# EasyEDA Pro project RM2025_超级电容控制器_IMCA.eprj, schematic 超电_V2.3.1

## Sheets
1 MCU及通信: Board Name: 超电V2.3; Create Date: 2025-06-12; Page Name: MCU及通信; Project Name: RM2025_超级电容控制器_IMCA; Schematic Name: 超电_V2.3.1; Update Date: 2025-06-12; Company: IMCA战队; Drawed: TJL; Page Size: A4; Version: V2.3.1
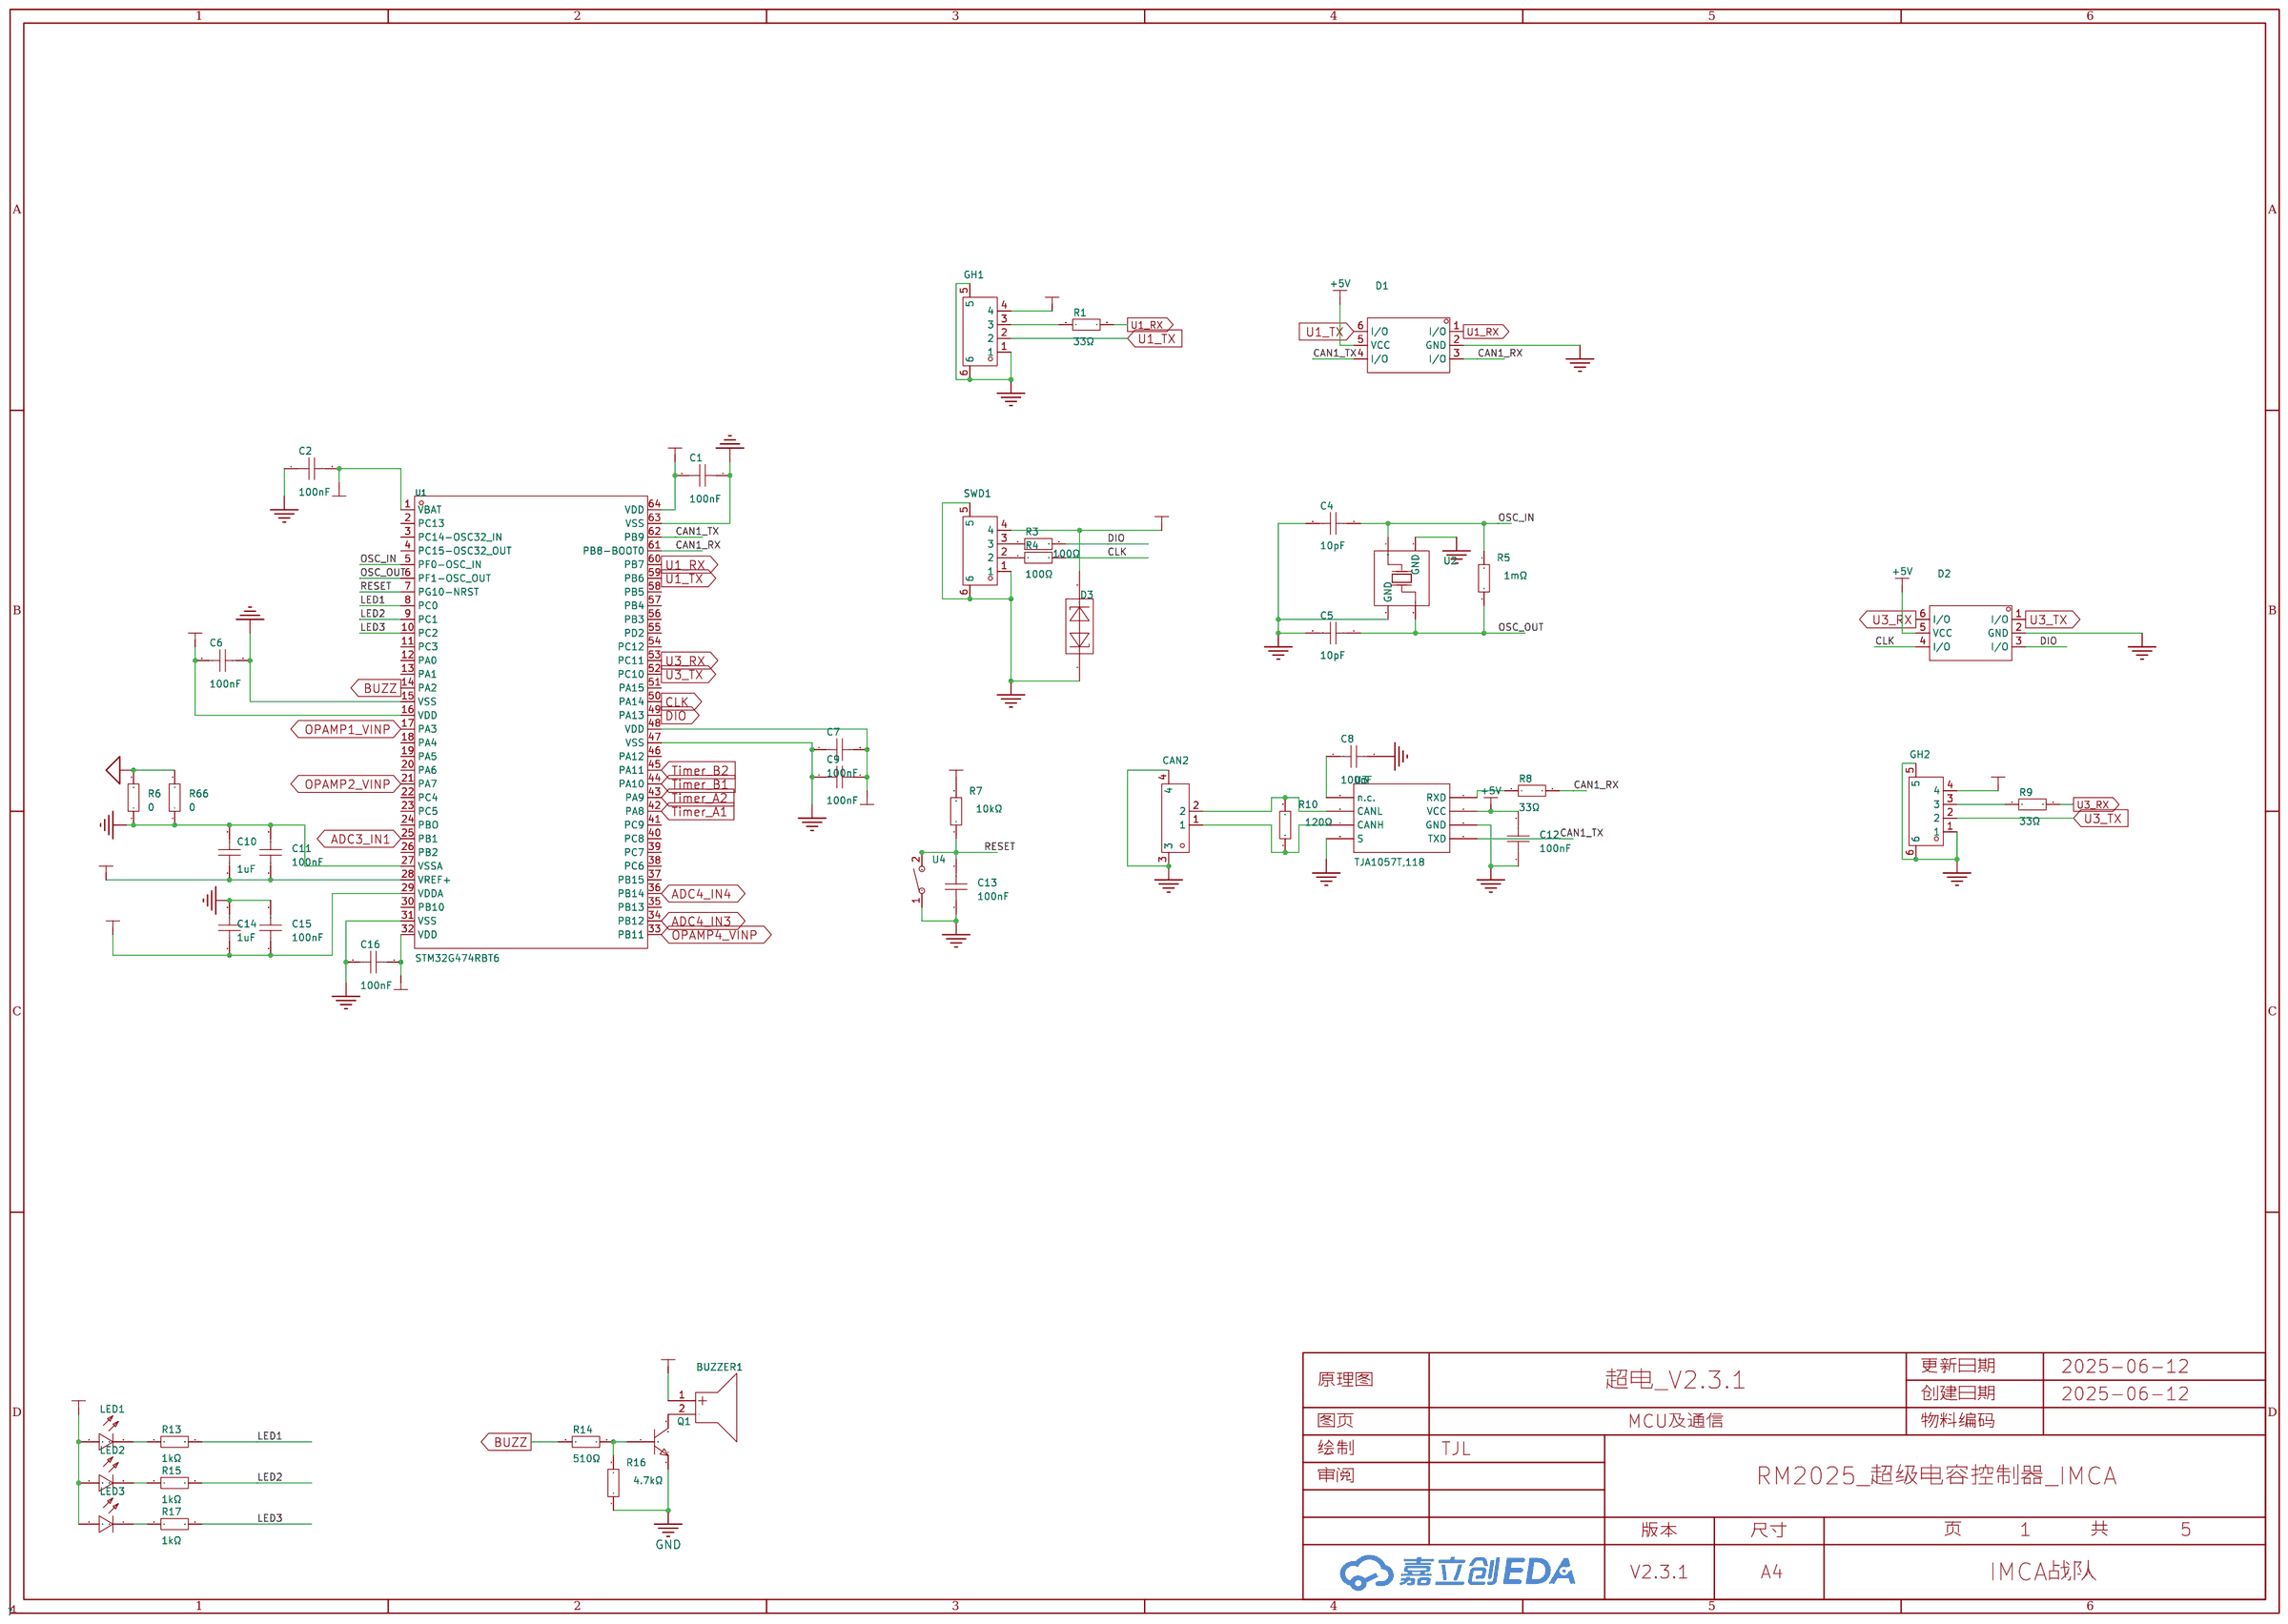
[diagram p0: MCU及通信]
2 主拓扑: Page Name: 主拓扑; Version: V1.0
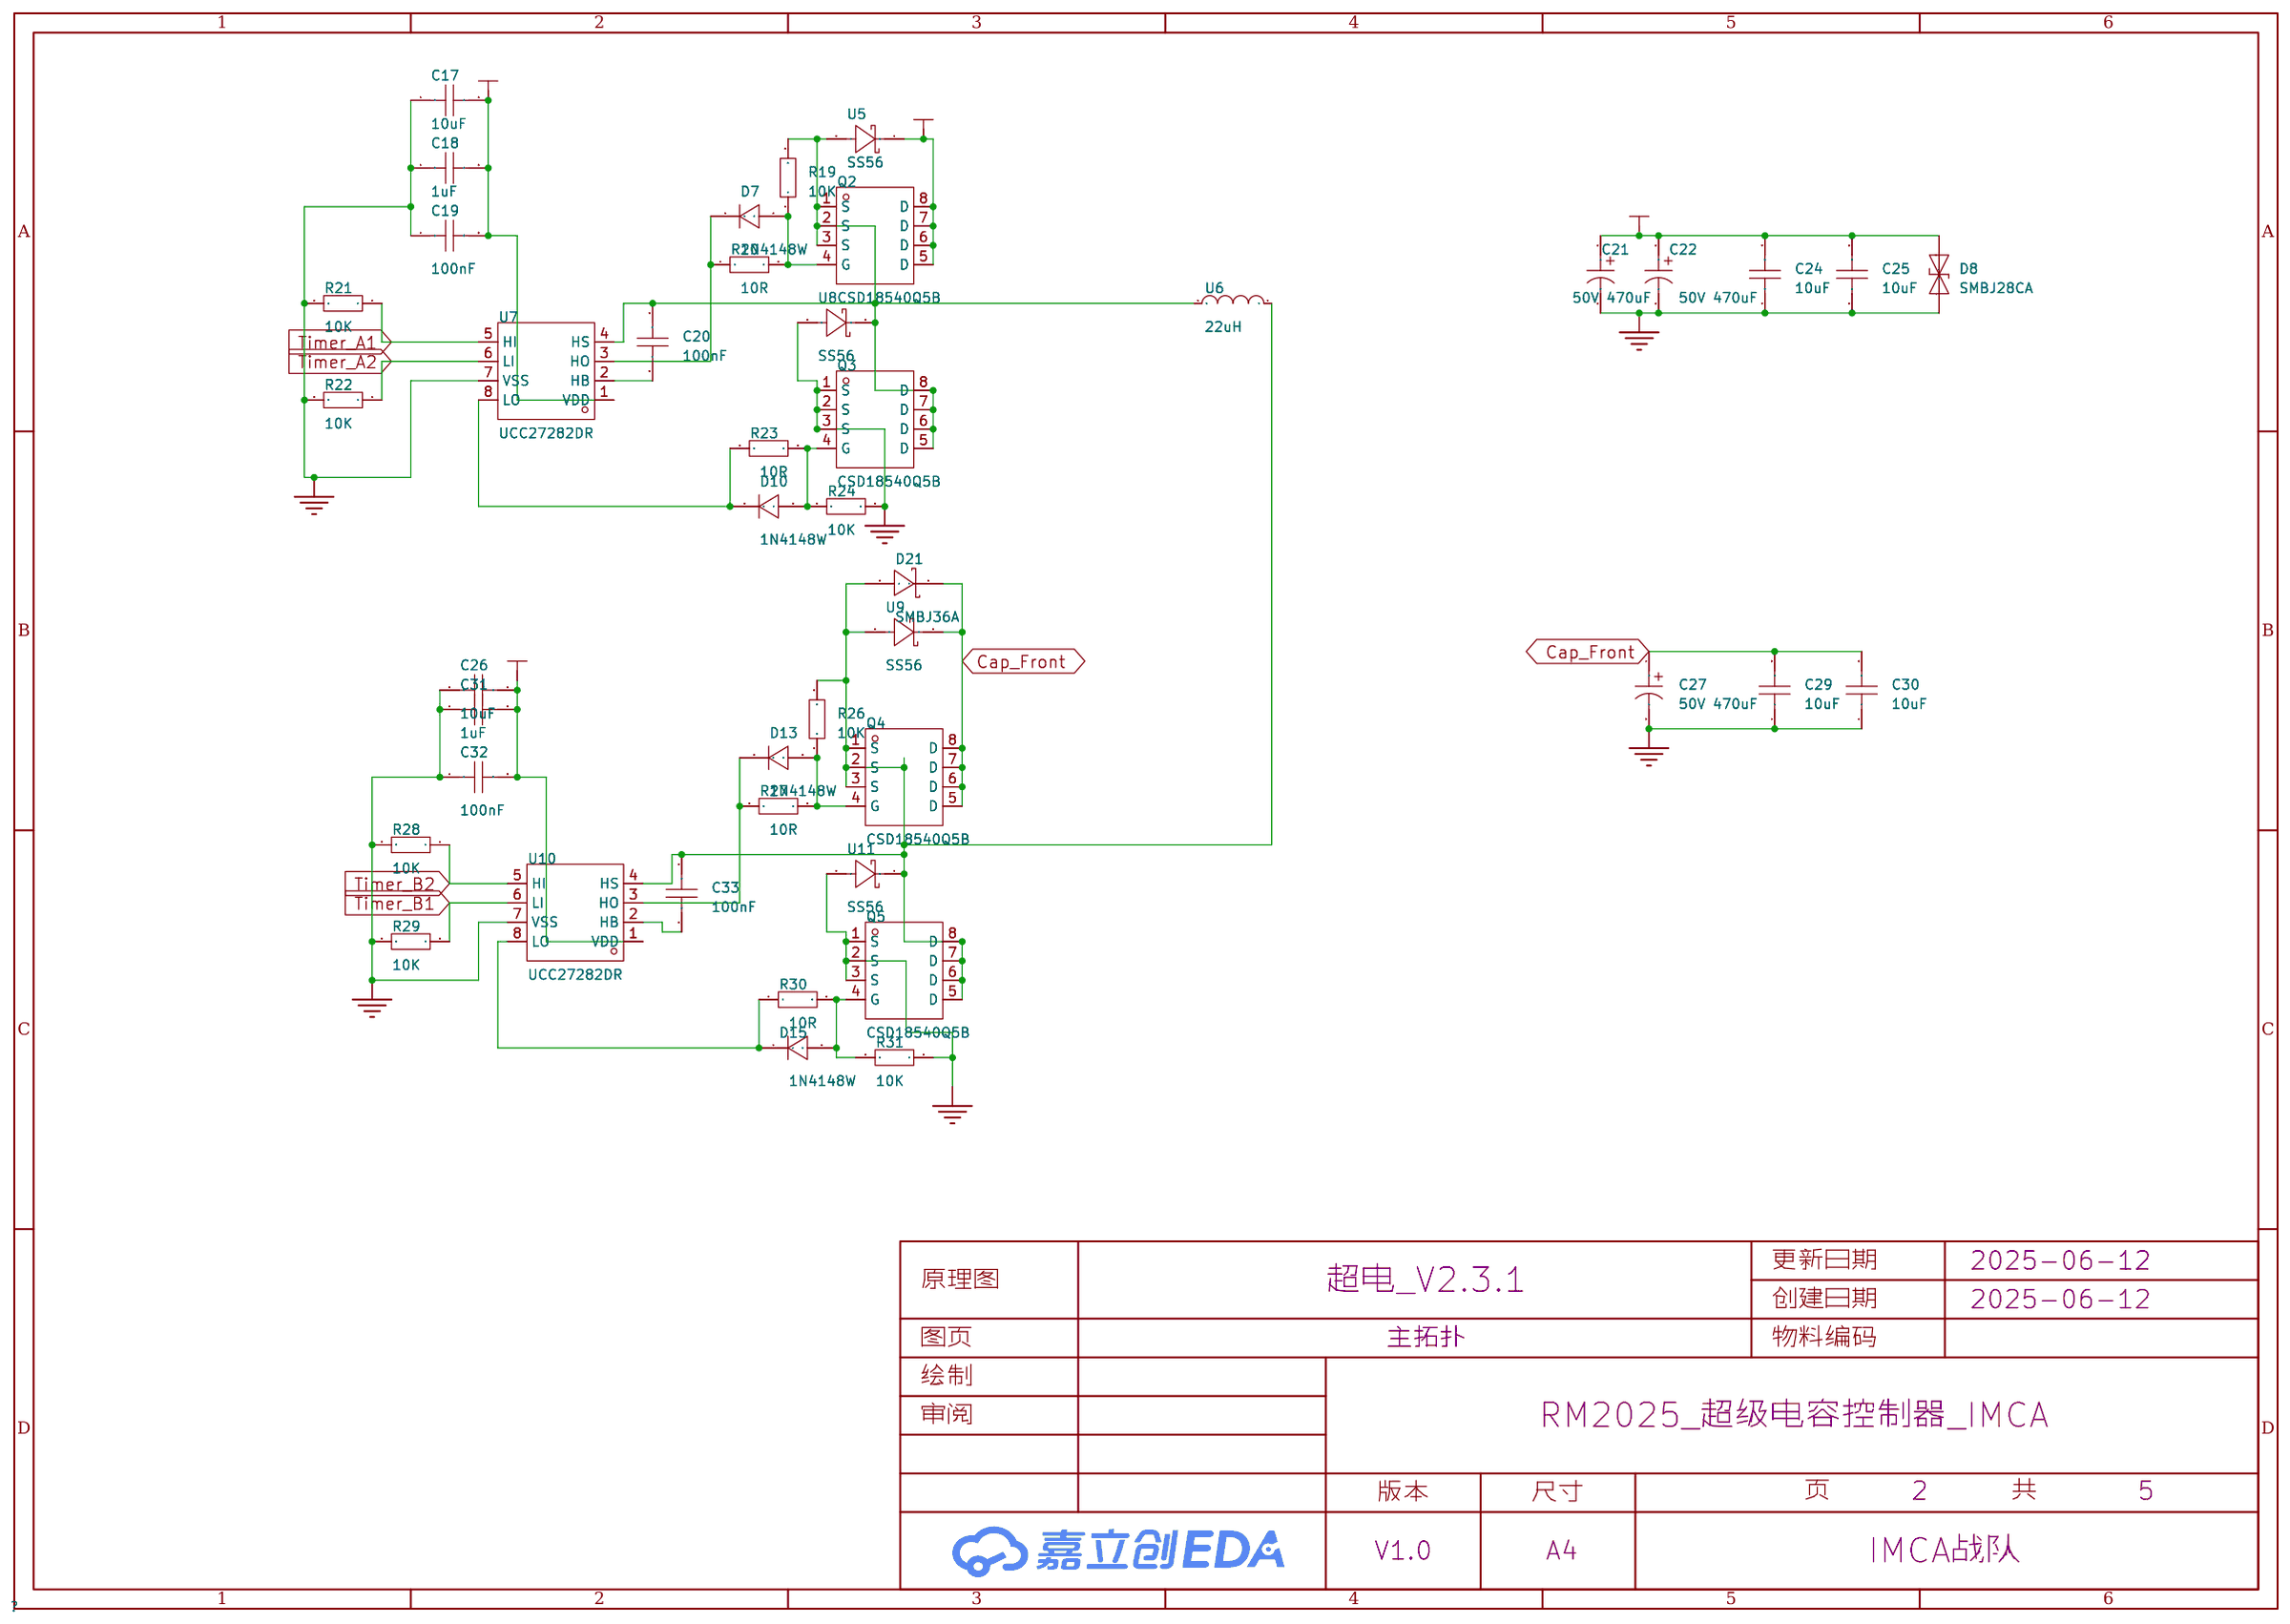
[diagram p1: 主拓扑]
3 电源: Page Name: 电源; Version: V1.0
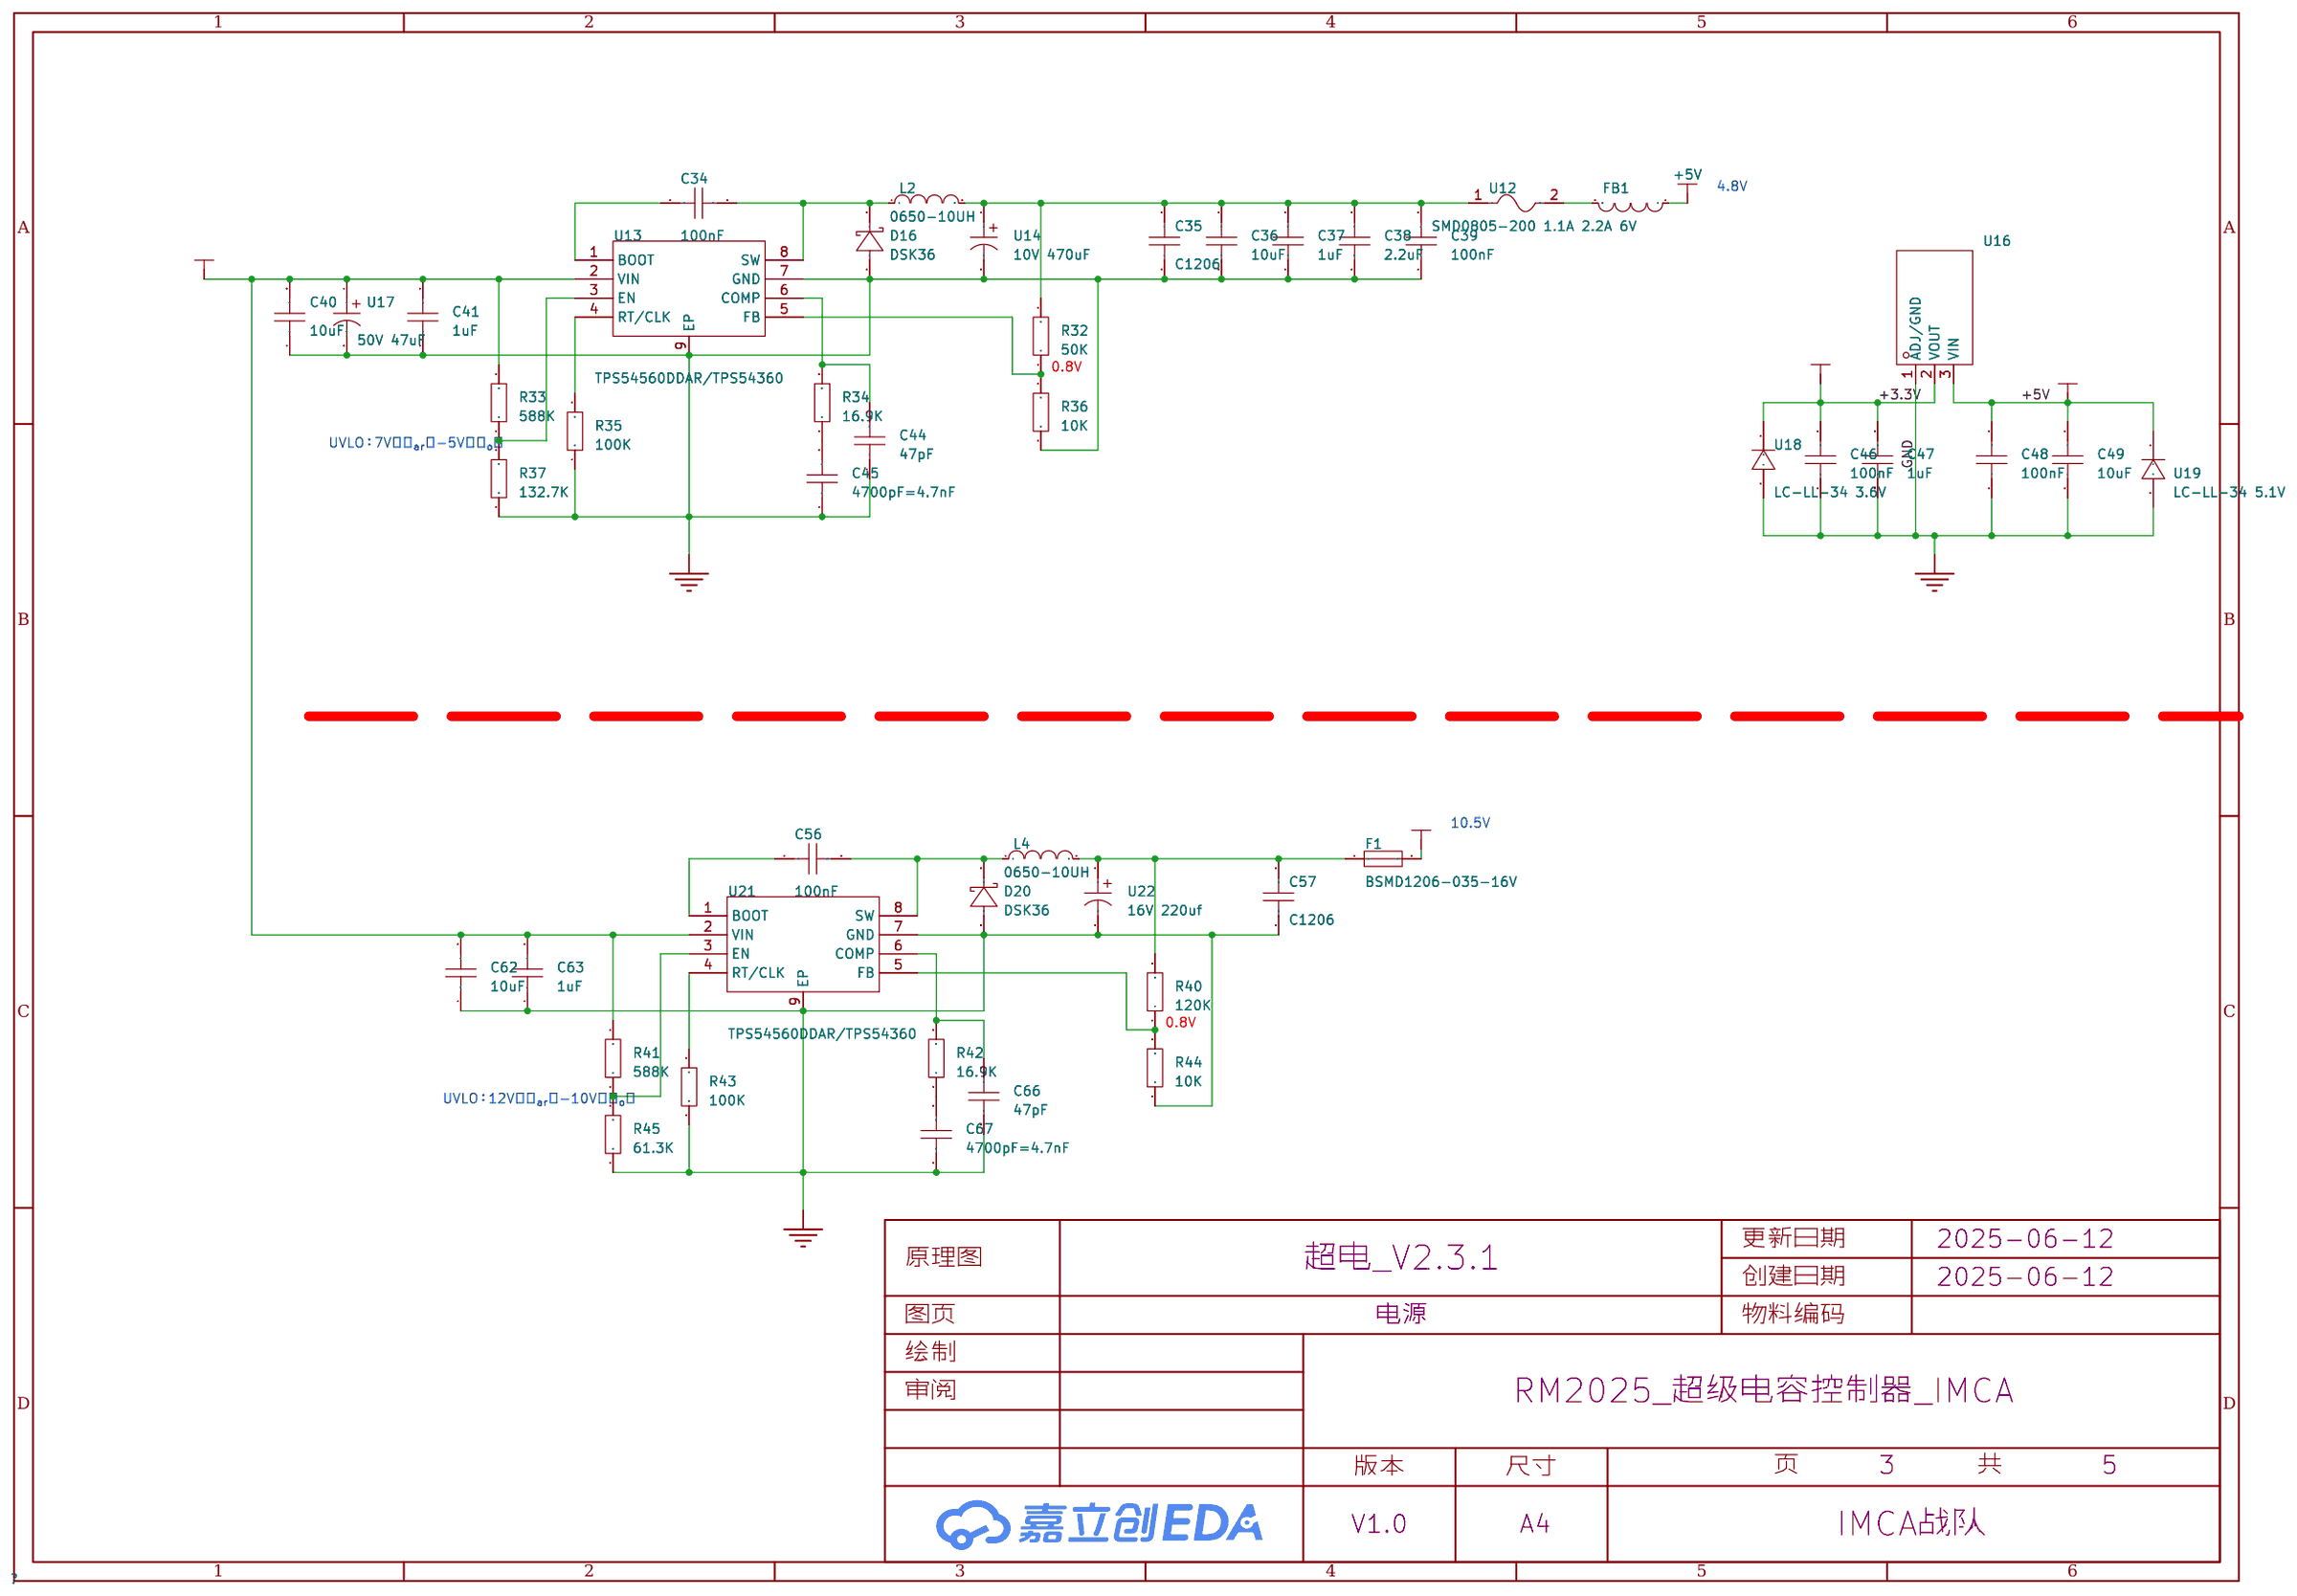
[diagram p2: 电源]
4 测量: Page Name: 测量; Version: V1.0
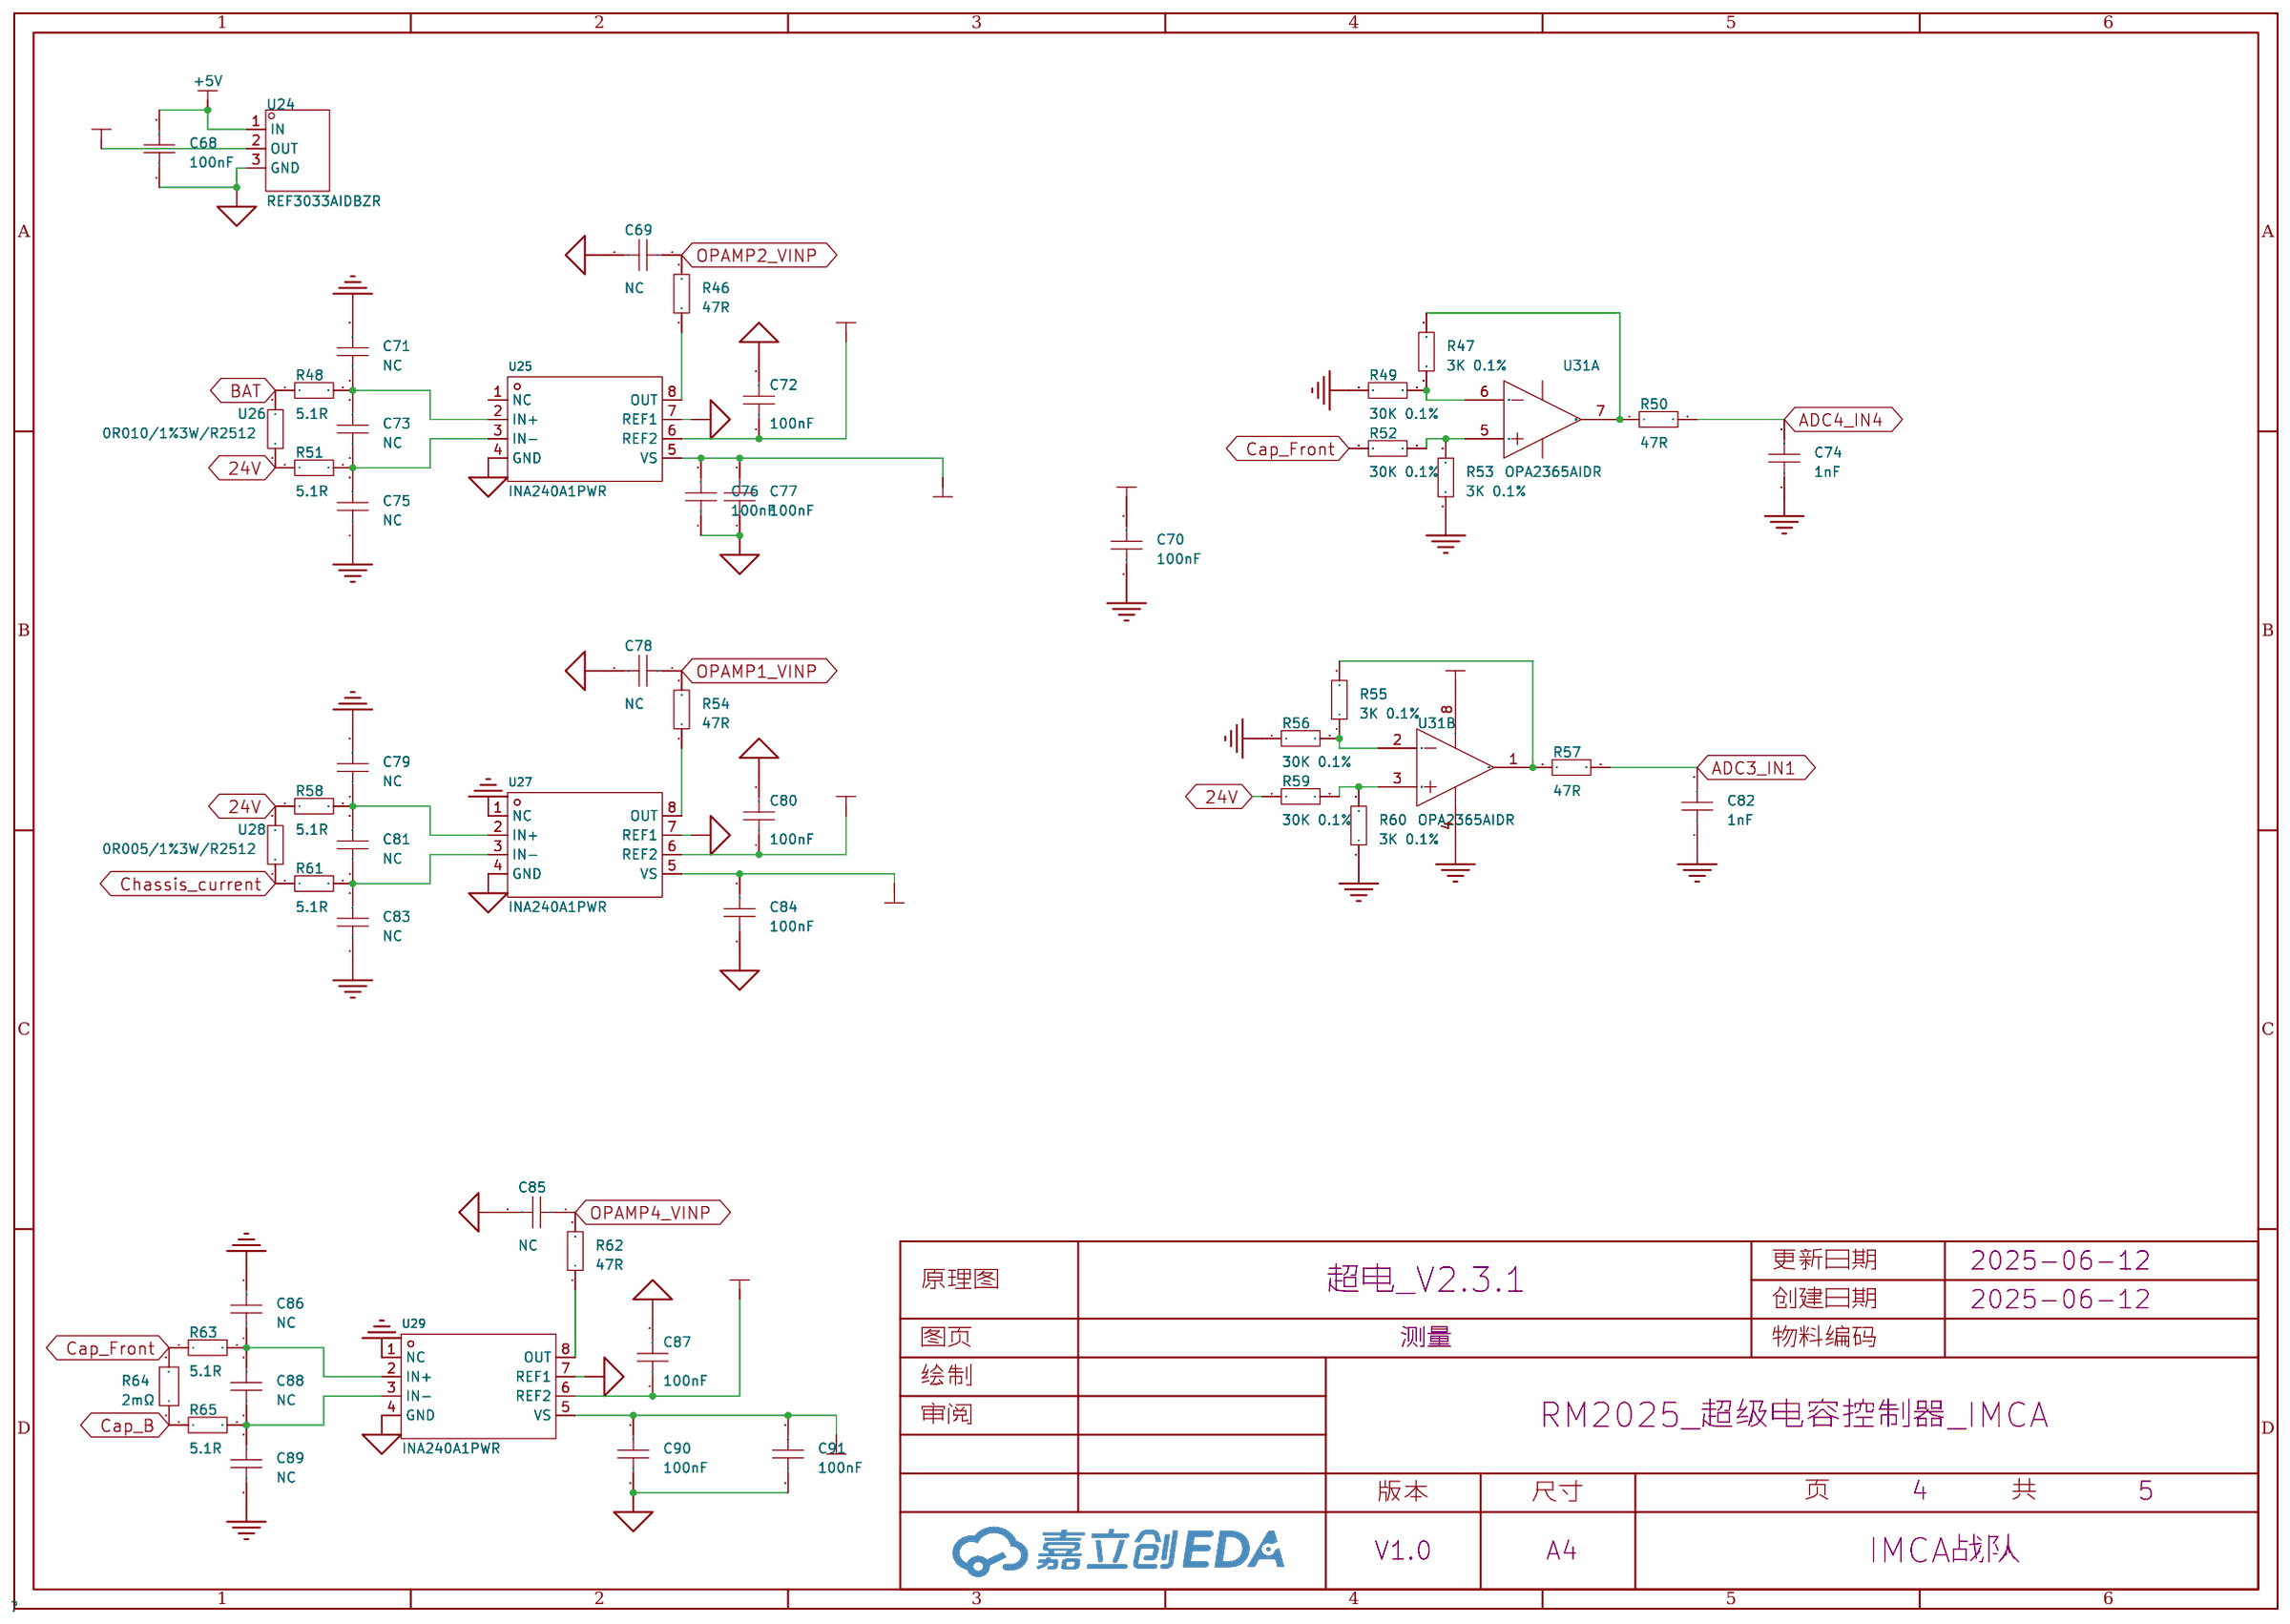
[diagram p3: 测量]
5 接口: Page Name: 接口; Part Number: 设计者：TJL; Version: V1.0
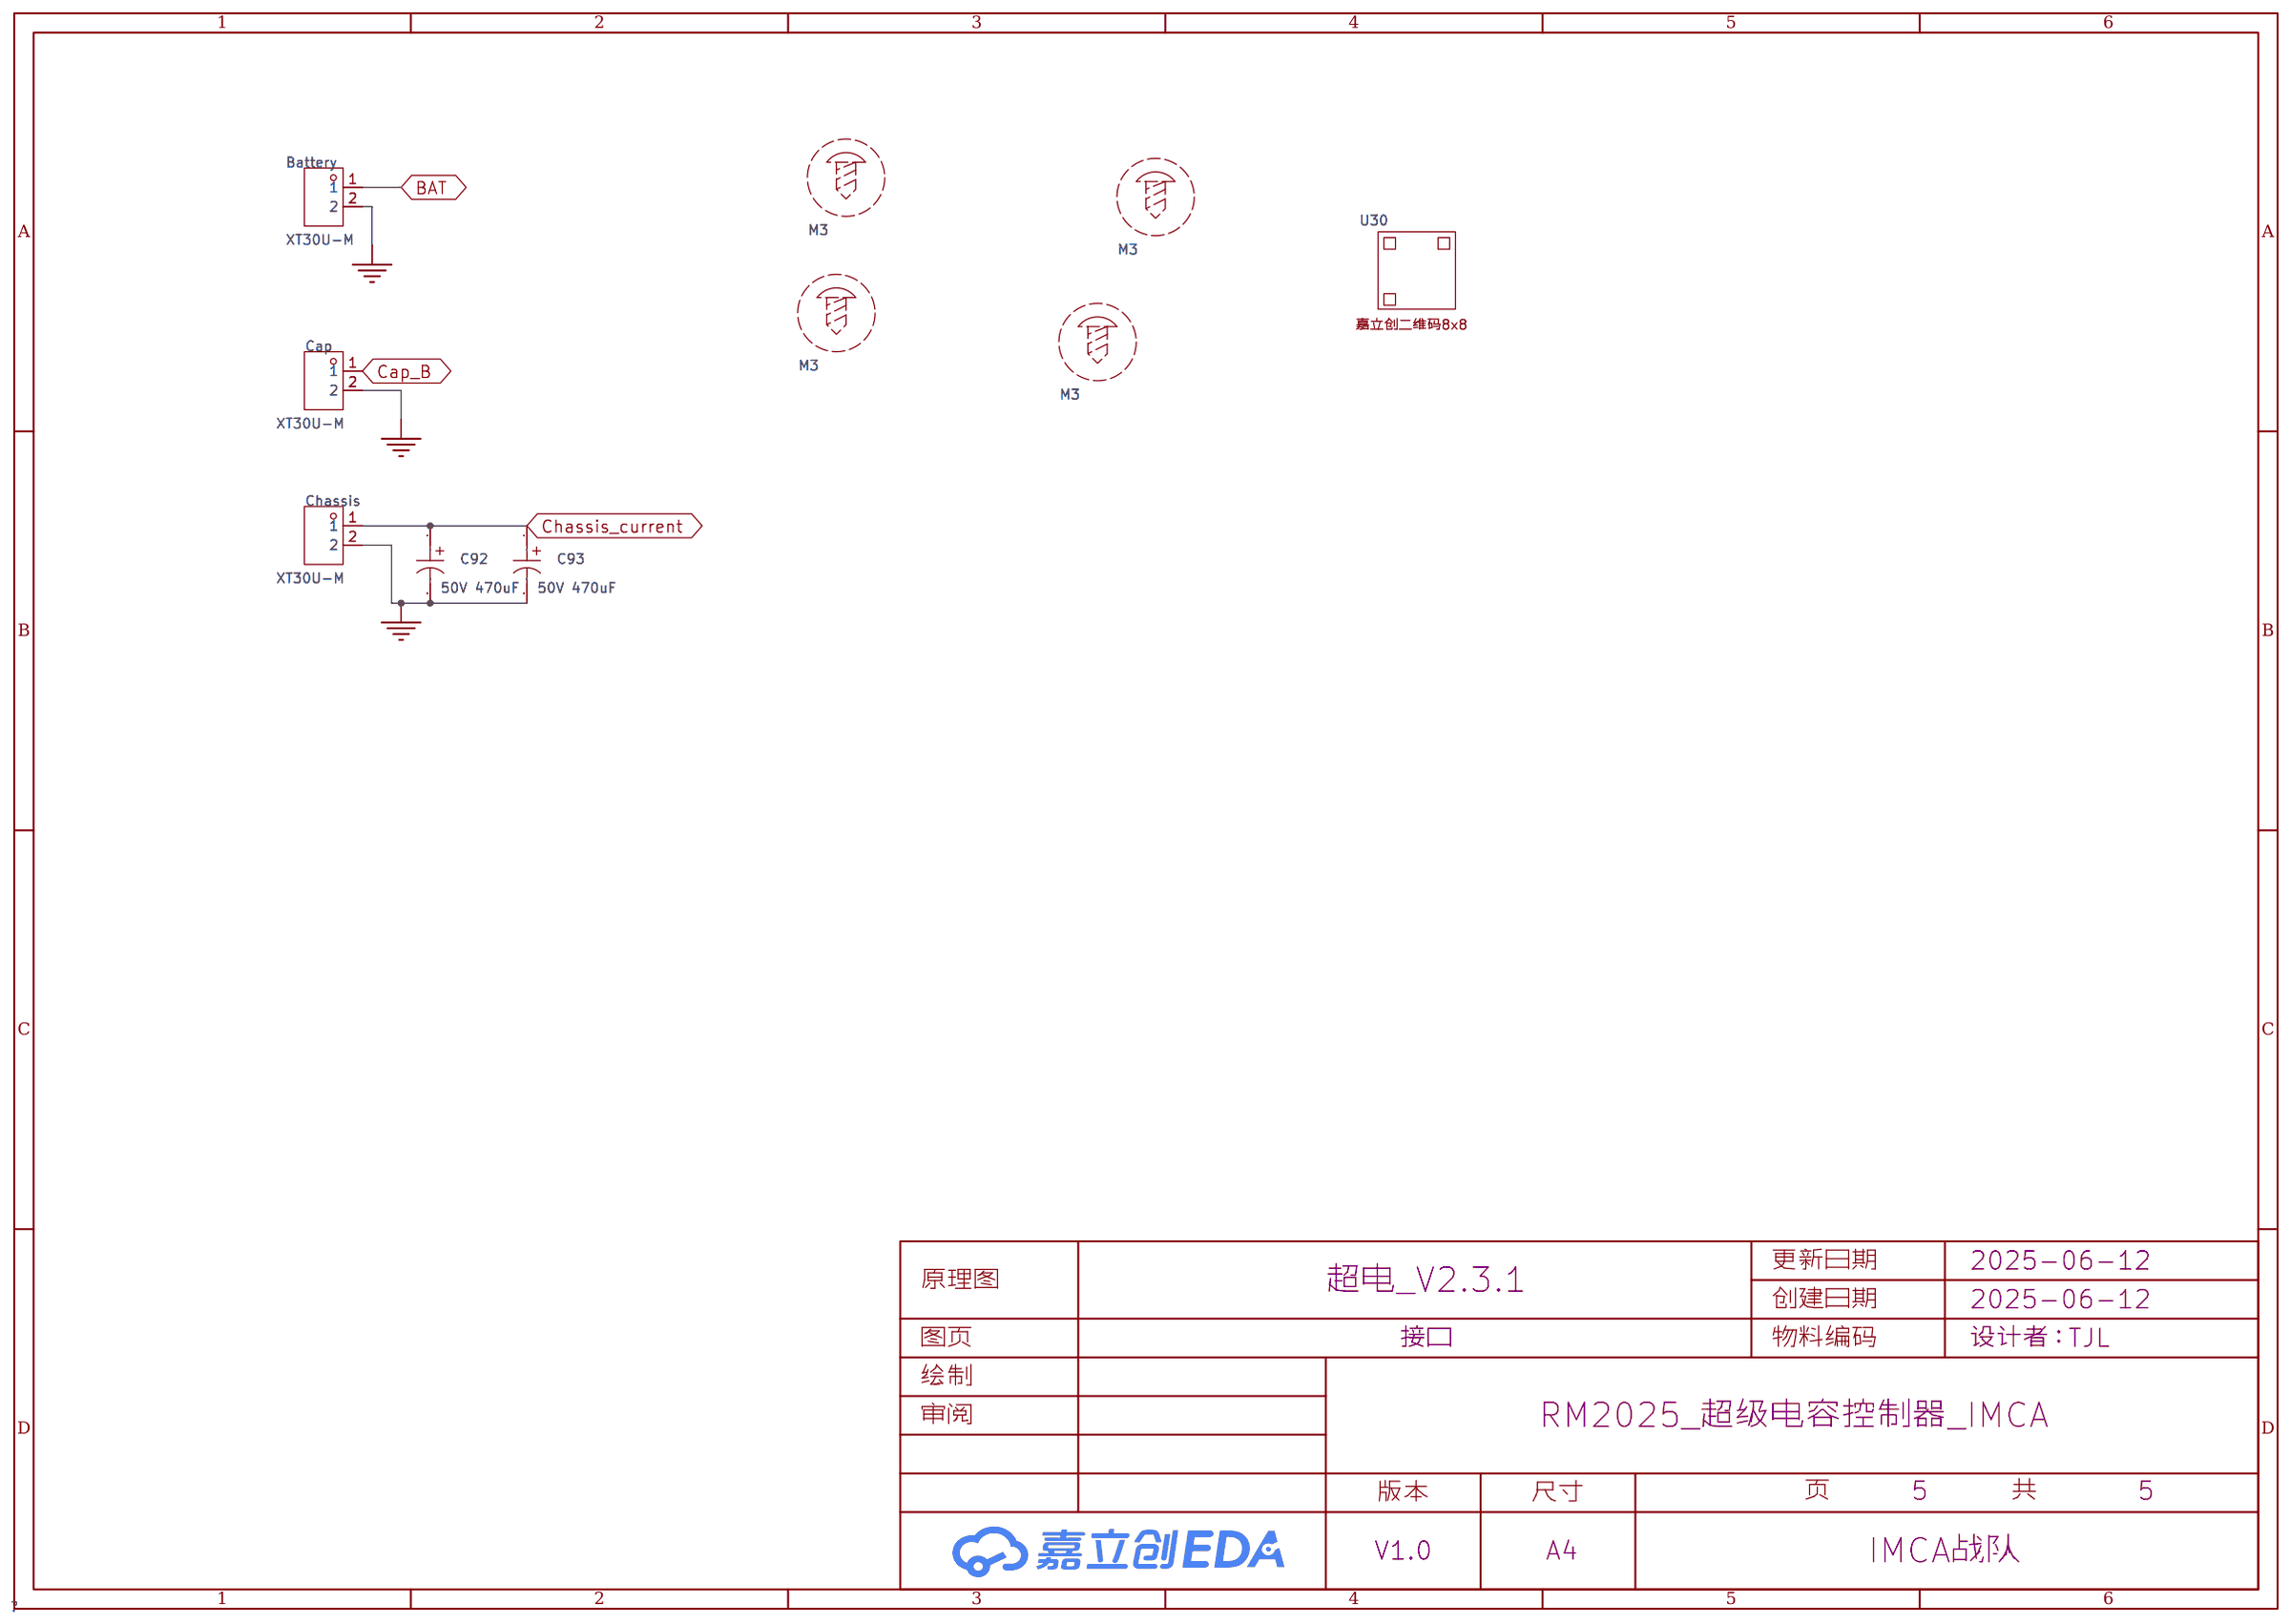
[diagram p4: 接口]

## Parts
sheet MCU及通信
BUZZER1  -  [BUZ-TH_BD9.0-P5.00-D0.6-L-FD]
C1  100nF  [C0603]
C2  100nF  [C0603]
C4  10pF  [C0603]
C5  10pF  [C0603]
C6  100nF  [C0603]
C7  100nF  [C0603]
C8  100nF  [C0603]
C9  100nF  [C0603]
C10  1uF  [C0603]
C11  100nF  [C0603]
C12  100nF  [C0603]
C13  100nF  [C0603]
C14  1uF  [C0603]
C15  100nF  [C0603]
C16  100nF  [C0603]
CAN2  -  [CONN-SMD_2P-P1.25_GH1.25-2P]
D1  SRV05-4HTG-D  [SOT-23-6_L2.9-W1.6-P0.95-LS2.8-BR]
D2  SRV05-4HTG-D  [SOT-23-6_L2.9-W1.6-P0.95-LS2.8-BR]
D3  -  [SOD-323_L1.8-W1.3-LS2.5-BI]
GH1  U1  [CONN-SMD_4P-P2.00_GH1.25-WS-4P]
GH2  U3  [CONN-SMD_4P-P2.00_GH1.25-WS-4P]
LED1  -  [LED0603-R-RD]
LED2  -  [LED0603-R-RD]
LED3  -  [LED0603-R-RD]
Q1  -  [SOT-23-3_L2.9-W1.3-P1.90-LS2.4-BR]
R1  33Ω  [R0603]
R3  100Ω  [R0603]
R4  100Ω  [R0603]
R5  1mΩ  [R0603]
R6  0  [R0603]
R7  10kΩ  [R0603]
R8  33Ω  [R0603]
R9  33Ω  [R0603]
R10  120Ω  [R0603]
R13  1kΩ  [R0603]
R14  510Ω  [R0603]
R15  1kΩ  [R0603]
R16  4.7kΩ  [R0603]
R17  1kΩ  [R0603]
R66  0  [R0201]
SWD1  -  [CONN-SMD_4P-P2.00_GH1.25-WS-4P]
U1  STM32G474RBT6  [LQFP-64_L10.0-W10.0-P0.50-LS12.0-BL]
U2  -  [CRYSTAL-SMD_4P-L3.2-W2.5-BL-2]
U3  TJA1057T,118  [SOIC-8_L4.9-W3.9-P1.27-LS6.0-BL]
U4  -  [SW-SMD_L4.0-W3.0-LS4.8-1]
sheet 主拓扑
C17  10uF  [C0603]
C18  1uF  [C0603]
C19  100nF  [C0603]
C20  100nF  [C0603]
C21  50V 470uF  [CAP-TH_BD10.0-P5.00-D0.6-FD-A]
C22  50V 470uF  [CAP-TH_BD10.0-P5.00-D0.6-FD-A]
C24  10uF  [C0603]
C25  10uF  [C0603]
C26  10uF  [C0603]
C27  50V 470uF  [CAP-TH_BD10.0-P5.00-D0.6-FD-A]
C29  10uF  [C0603]
C30  10uF  [C0603]
C31  1uF  [C0603]
C32  100nF  [C0603]
C33  100nF  [C0603]
D7  1N4148W  [SOD-123F_L2.7-W1.6-LS3.8-RD]
D8  SMBJ28CA  [SMB_L4.6-W3.6-LS5.3-BI]
D10  1N4148W  [SOD-123F_L2.7-W1.6-LS3.8-RD]
D13  1N4148W  [SOD-123F_L2.7-W1.6-LS3.8-RD]
D15  1N4148W  [SOD-123F_L2.7-W1.6-LS3.8-RD]
D21  SMBJ36A  [SMB_L4.6-W3.6-LS5.3-RD]
Q2  CSD18540Q5B  [VSON-CLIP-8_L5.0-W6.0-P1.27-BL]
Q3  CSD18540Q5B  [VSON-CLIP-8_L5.0-W6.0-P1.27-BL]
Q4  CSD18540Q5B  [VSON-CLIP-8_L5.0-W6.0-P1.27-BL]
Q5  CSD18540Q5B  [VSON-CLIP-8_L5.0-W6.0-P1.27-BL]
R19  10K  [R0603]
R20  10R  [R0603]
R21  10K  [R0603]
R22  10K  [R0603]
R23  10R  [R0603]
R24  10K  [R0603]
R26  10K  [R0603]
R27  10R  [R0603]
R28  10K  [R0603]
R29  10K  [R0603]
R30  10R  [R0603]
R31  10K  [R0603]
U5  SS56  [SMA_L4.2-W2.6-LS5.1-RD]
U6  22uH  [PQ2620_LL]
U7  UCC27282DR  [SOIC-8_L4.9-W3.9-P1.27-LS6.0-BL]
U8  SS56  [SMA_L4.2-W2.6-LS5.1-RD]
U9  SS56  [SMA_L4.2-W2.6-LS5.1-RD]
U10  UCC27282DR  [SOIC-8_L4.9-W3.9-P1.27-LS6.0-BL]
U11  SS56  [SMA_L4.2-W2.6-LS5.1-RD]
sheet 接口
Battery  XT30U-M  [CONN-TH_XT30U-M]
C92  50V 470uF  [CAP-TH_BD10.0-P5.00-D0.6-FD-A]
C93  50V 470uF  [CAP-TH_BD10.0-P5.00-D0.6-FD-A]
Cap  XT30U-M  [CONN-TH_XT30U-M]
Chassis  XT30U-M  [CONN-TH_XT30U-M]
M1  M3  [M3_cut_out]  (no BOM)
M2  M3  [M3_cut_out]  (no BOM)
M3  M3  [M3_cut_out]  (no BOM)
M4  M3  [M3_cut_out]  (no BOM)
U30  -  [JLC-QRCODE-8x8]
sheet 测量
C68  100nF  [C0603]
C69  NC  [C0603]
C70  100nF  [C0603]
C71  NC  [C0603]
C72  100nF  [C0603]
C73  NC  [C0603]
C74  1nF  [C0603]
C75  NC  [C0603]
C76  100nF  [C0603]
C77  100nF  [C0603]
C78  NC  [C0603]
C79  NC  [C0603]
C80  100nF  [C0603]
C81  NC  [C0603]
C82  1nF  [C0603]
C83  NC  [C0603]
C84  100nF  [C0603]
C85  NC  [C0603]
C86  NC  [C0603]
C87  100nF  [C0603]
C88  NC  [C0603]
C89  NC  [C0603]
C90  100nF  [C0603]
C91  100nF  [C0603]
R46  47R  [R0603]
R47  3K 0.1%  [R0603]
R48  5.1R  [R0603]
R49  30K 0.1%  [R0603]
R50  47R  [R0603]
R51  5.1R  [R0603]
R52  30K 0.1%  [R0603]
R53  3K 0.1%  [R0603]
R54  47R  [R0603]
R55  3K 0.1%  [R0603]
R56  30K 0.1%  [R0603]
R57  47R  [R0603]
R58  5.1R  [R0603]
R59  30K 0.1%  [R0603]
R60  3K 0.1%  [R0603]
R61  5.1R  [R0603]
R62  47R  [R0603]
R63  5.1R  [R0603]
R64  2mΩ  [RES-SMD_L6.3-W3.3_HOLR2512]
R65  5.1R  [R0603]
U24  REF3033AIDBZR  [SOT-23-3_L3.0-W1.7-P0.95-LS2.9-BR]
U25  INA240A1PWR  [TSSOP-8_L4.4-W3.0-P0.65-LS6.4-BL]
U26  0R010/1%3W/R2512  [R2512]
U27  INA240A1PWR  [TSSOP-8_L4.4-W3.0-P0.65-LS6.4-BL]
U28  0R005/1%3W/R2512  [R2512]
U29  INA240A1PWR  [TSSOP-8_L4.4-W3.0-P0.65-LS6.4-BL]
U31  OPA2365AIDR  [SOIC-8_L4.9-W3.9-P1.27-LS6.0-BL]  (sections 1,2)
sheet 电源
C34  100nF  [C0603]
C35  C1206  [C1206]
C36  10uF  [C0603]
C37  1uF  [C0603]
C38  2.2uF  [C0603]
C39  100nF  [C0603]
C40  10uF  [C0603]
C41  1uF  [C0603]
C44  47pF  [C0603]
C45  4700pF=4.7nF  [C0603]
C46  100nF  [C0603]
C47  1uF  [C0603]
C48  100nF  [C0603]
C49  10uF  [C0603]
C56  100nF  [C0603]
C57  C1206  [C1206]
C62  10uF  [C0603]
C63  1uF  [C0603]
C66  47pF  [C0603]
C67  4700pF=4.7nF  [C0603]
D16  DSK36  [SOD-123FL_L2.8-W1.8-LS3.7-R-RD]
D20  DSK36  [SOD-123FL_L2.8-W1.8-LS3.7-R-RD]
F1  BSMD1206-035-16V  [F1206]
FB1  GZ1608D601TF  [L0603]
L2  10uH  [IND-SMD_L7.8-W7.0_MAPM0630F]
L4  10uH  [IND-SMD_L7.8-W7.0_MAPM0630F]
R32  50K  [R0603]
R33  588K  [R0603]
R34  16.9K  [R0603]
R35  100K  [R0603]
R36  10K  [R0603]
R37  132.7K  [R0603]
R40  120K  [R0603]
R41  588K  [R0603]
R42  16.9K  [R0603]
R43  100K  [R0603]
R44  10K  [R0603]
R45  61.3K  [R0603]
U12  SMD0805-200 1.1A 2.2A 6V  [F0805]
U13  TPS54560DDAR/TPS54360  [SOIC-8_L5.0-W4.0-P1.27-LS6.0-BL-EP2.0]
U14  10V 470uF  [CAP-SMD_BD6.3-L6.6-W6.6-LS7.2-FD]
U16  -  [SOT-89-3_L4.5-W2.5-P1.50-LS4.2-BR]
U17  50V 47uF  [CAP-SMD_BD6.3-L6.6-W6.6-LS7.2-FD]
U18  LC-LL-34 3.6V  [LL-34_L3.5-W1.5-RD]
U19  LC-LL-34 5.1V  [LL-34_L3.5-W1.5-RD]
U21  TPS54560DDAR/TPS54360  [SOIC-8_L5.0-W4.0-P1.27-LS6.0-BL-EP2.0]
U22  16V 220uf  [CAP-SMD_BD6.3-L6.6-W6.6-LS7.2-FD]

## Library data of the parts
BUZZER1 = 有源蜂鸣器直径9*5.5mm3V: Supplier Part: C9900012728; Supplier Footprint: 0905; JLCPCB Part Class: Extended Part; Datasheet: https://atta.szlcsc.comnull; Supplier: LCSC
C1 C2 C6-C20 C24-C26 C29-C34 C36-C41 C44-C49 C56 C62 C63 C66-C91 = CAP_0603: Supplier Footprint: 0603
C4 C5 = CC0603KRX7R9BB104: 容值:100nF;精度:±10%;额定电压:50V;温度系数:X7R;; LCSC Part Name: 100nF ±10% 50V; Supplier Part: C14663; Manufacturer: YAGEO(国巨); Supplier Footprint: 0603; JLCPCB Part Class: Basic Part; Datasheet: https://atta.szlcsc.com/upload/public/pdf/source/20170116/1484561234239.pdf; Supplier: LCSC; Tolerance: ±10%; Voltage Rated: 50V; Temperature Coefficient: X7R
CAN2 = GH1.25-2PLTPZ: LCSC Part Name: GH1.25-2P立贴编带加盖; Supplier Part: C2829260; Manufacturer: BOOMELE(博穆精密); JLCPCB Part Class: Extended Part; Datasheet: https://atta.szlcsc.com/upload/public/pdf/source/20211125/08A09A4909F58AF780B71FE423A00F7E.pdf; Supplier: LCSC
D1 D2 = SRV05-4HTG-D: 反向截止电压(Vrwm):6V@Max;最大钳位电压:15V;峰值脉冲电流(Ipp)@10/1000us:10A@8/20us;峰值脉冲功率(Ppp)@10/1000us:150W;击穿电压:6V;; Supplier Part: C1975211; Manufacturer: Littelfuse(美国力特); Supplier Footprint: SOT-23-6; JLCPCB Part Class: Extended Part; Datasheet: https://atta.szlcsc.com/upload/public/pdf/source/20240123/505FC9A4C50EE2C325A36E8FCBE5958F.pdf; Supplier: LCSC; Reverse Stand-Off Voltage (Vrwm): 6V@Max; Maximum Clamping Voltage: 15V; Peak Pulse Current (Ipp)@10/1000us: 10A@8/20us; Peak Pulse Power Dissipation (Ppp)@10/1000us: 150W; Breakdown Voltage: 6V; Type: TVS
D3 = PESD5V0L1BA,115: 极性:Bidirectional;反向关断电压（典型值）:5V;击穿电压（最小值）:7V;箝位电压:33V;峰值脉冲电流（10/1000us）:15A;; Supplier Part: C85380; Manufacturer: Nexperia(安世); Supplier Footprint: SOD-323; Datasheet: https://atta.szlcsc.com/upload/public/pdf/source/20170606/1496716521338.pdf; Supplier: LCSC; Polarity: Bidirectional; Voltage - Reverse Standoff (Typ): 5V; Voltage - Breakdown (Min): 7V; Voltage - Clamping (Max) @ Ipp: 33V; Current - Peak Pulse (10/1000μs): 15A
GH1 GH2 SWD1 = GH1.25-WS-4P: Supplier Part: C9900004350; Supplier Footprint: SMD-4; JLCPCB Part Class: Extended Part; Supplier: LCSC
LED1-LED3 = 19-217/GHC-YR1S2/3T: 照明颜色:翠绿;色温 - CCT（K）:-;主波长/色坐标:520~535nm;; LCSC Part Name: 翠绿LED; Supplier Part: C72043; Manufacturer: EVERLIGHT(台湾亿光); Supplier Footprint: 0603; JLCPCB Part Class: Basic Part; Datasheet: https://atta.szlcsc.com/upload/public/pdf/source/20160507/1462613613780.pdf; Supplier: LCSC; Mounting Type: 表面贴装; Illumination Color: 翠绿; Luminous Intensity (IF=20mA): 112~258mcd; Dominant Wavelength / Coordinate rank: 520~535nm
Q1 = SS8050: 额定功率:300mW;集电极电流Ic:1.5A;集射极击穿电压Vce:25V;晶体管类型:NPN;; LCSC Part Name: SS8050  H档 200-350; Supplier Part: C139513; Supplier Footprint: SOT-23(SOT-23-3); JLCPCB Part Class: Extended Part; Datasheet: https://atta.szlcsc.com/upload/public/pdf/source/20171116/C139513_15108221319471123743.pdf; Supplier: LCSC
R1 R3-R5 R7-R9 R13 R15 R17 = TR0603B10K0P0525Z: 电阻类型:薄膜电阻;阻值:10kΩ;精度:±0.1%;功率:100mW;温度系数:±25ppm/;最大工作电压:75V;工作温度范围:-55~+155;; LCSC Part Name: 10kΩ ±0.1%; Supplier Part: C188363; Manufacturer: EVER OHMS(天二科技); Supplier Footprint: 0603; JLCPCB Part Class: Extended Part; Datasheet: https://atta.szlcsc.com/upload/public/pdf/source/20190415/C188363_433BF05B6FB8F7A0F5F35A3E4390C55A.pdf; Supplier: LCSC; Type: 薄膜电阻; Tolerance: ±0.1%; Power(Watts): 100mW; Temperature Coefficient: ±25ppm/; Overload Voltage (Max): 75V; Operating Temperature Range: -55~+155
R6 R19-R24 R26-R37 R40-R63 R65 = Res_0603: Supplier Footprint: 0603
R10 R14 R16 = TR0603B10K0P0525Z: 电阻类型:薄膜电阻;阻值:10kΩ;精度:±0.1%;功率:100mW;温度系数:±25ppm/;最大工作电压:75V;工作温度范围:-55~+155;; LCSC Part Name: 10kΩ ±0.1% 100mW; Supplier Part: C188363; Manufacturer: EVER OHMS(天二科技); Supplier Footprint: 0603; JLCPCB Part Class: Extended Part; Datasheet: https://atta.szlcsc.com/upload/public/pdf/source/20190415/C188363_433BF05B6FB8F7A0F5F35A3E4390C55A.pdf; Supplier: LCSC; Type: 薄膜电阻; Tolerance: ±0.1%; Power(Watts): 100mW; Temperature Coefficient: ±25ppm/; Overload Voltage (Max): 75V; Operating Temperature Range: -55~+155
R66 = Res_0201: Supplier Footprint: 0201
U1 = STM32G474RBT6: CPU内核:CM4;程序存储容量:128KB;RAM总容量:128KB;GPIO端口数量:52;工作电压范围:1.71V~3.6V;CPU最大主频:170MHz;程序存储器类型:FLASH;; Supplier Part: C529413; Manufacturer: ST(意法半导体); Supplier Footprint: LQFP-64(10x10); JLCPCB Part Class: 扩展库; Datasheet: https://atta.szlcsc.com/upload/public/pdf/source/20200511/C529413_E65C05BC9222C60DA6E2B31FEBB7BDD5.pdf; Supplier: LCSC; CPU Core: CM4; Program Storage Size: 128KB; RAM Size: 128KB; GPIO Ports Number: 52; Operating Voltage Range: 1.71V~3.6V; CPU Maximum Speed: 170MHz; Program Memory Type: FLASH; Operating Temperature Range: -40℃~+85℃; ADC (Bit): 12bit; DAC (Bit): 12bit; Peripheral/Function: DMA；PWM; Internal Oscillator: 有
U2 = SMDOSCC25X32X11: Supplier Part: C9900021590; Supplier Footprint: 晶振3225; JLCPCB Part Class: Extended Part; Datasheet: https://atta.szlcsc.comnull; Supplier: LCSC
U3 = TJA1057T,118: 类型:收发器;数据速率:5Mbps;; LCSC Part Name: 5Mbps 4.75V~5.25V; Supplier Part: C113349; Manufacturer: NXP(恩智浦); Supplier Footprint: SOIC-8; JLCPCB Part Class: 扩展库; Datasheet: https://atta.szlcsc.com/upload/public/pdf/source/20170606/1496716409752.pdf; Supplier: LCSC; Type: 收发器; Data Rate: 5Mbps; Supply Voltage: 4.75V~5.25V; Operating Temperature: -40℃~+150℃
U4 = 3*4 龟仔/微动/轻触开关: Supplier Part: C9900001368; Supplier Footprint: SMD; JLCPCB Part Class: Extended Part; Supplier: LCSC
C21 C22 C27 C92 C93 = 160AREP222M10B0L05T: 容值:2200uF;精度:±20%;额定电压:16V;纹波电流:8.1A@100kHz;等效串联电阻:8mΩ@100kHz~300kHz;类型:聚合物;; LCSC Part Name: 2200uF ±20% 16V; Supplier Part: C2974490; Manufacturer: APAQ(钰邦); Supplier Footprint: 插件,D10xL20mm; JLCPCB Part Class: 扩展库; Datasheet: https://atta.szlcsc.com/upload/public/pdf/source/20211229/7FDCE02738FD57E885AF62BB1AC1D0A4.pdf; Supplier: LCSC; Tolerance: ±20%; Rated Voltage: 35V; Ripple Current: 8.1A@100kHz; Equivalent Series Resistance(ESR): 8mΩ@100kHz~300kHz; Type: 聚合物; Lead Spacing: 5mm; φD: 10mm; L: 20mm; Lifetime @ Temp: 2000hrs@105℃; Operating Temperature: 125
D7 D10 D13 D15 = 1N4148W_C81598: 二极管配置:独立式;正向压降(Vf):1V@50mA;直流反向耐压(Vr):75V;平均整流电流(Io):150mA;功率:400mW;反向恢复时间(trr):4ns;; LCSC Part Name: 电压:75V 电流:150mA; Supplier Part: C81598; Manufacturer: ST(先科); Supplier Footprint: SOD-123; JLCPCB Part Class: 基础库; Datasheet: https://atta.szlcsc.com/upload/public/pdf/source/20161024/1477288446905.pdf; Supplier: LCSC; Diode Configuration: 独立式; Forward Voltage (Vf@If): 1V@50mA; Reverse Voltage (Vr): 75V; Average Rectified Current (Io): 150mA; Power Dissipation: 400mW; Reverse Leakage Current: 1uA@75V; Reverse Recovery Time (trr): 4ns
D8 = SMBJ28CA: 反向截止电压(Vrwm):28V;最大钳位电压:45.4V;峰值脉冲电流(Ipp)@10/1000us:13.2A;击穿电压:31.1V;; Supplier Part: C356756; Manufacturer: JJW(捷捷微); Supplier Footprint: SMB(DO-214AA); JLCPCB Part Class: 扩展库; Datasheet: https://atta.szlcsc.com/upload/public/pdf/source/20190118/C364661_581AFCFF6ECC065E7F89B606E0837F4E.pdf; Supplier: LCSC; Reverse Stand-Off Voltage (Vrwm): 28V; Maximum Clamping Voltage: 45.4V; Peak Pulse Current (Ipp)@10/1000us: 13.2A; Breakdown Voltage: 31.1V; Reverse Leakage Current (Ir): 1uA; Type: TVS
D21 = SMBJ36A: 反向截止电压(Vrwm):36V;最大钳位电压:58.1V;峰值脉冲电流(Ipp):10.3A;击穿电压:40V;; Supplier Part: C143165; Manufacturer: FMS(美丽微); Supplier Footprint: SMB(DO-214AA); JLCPCB Part Class: 扩展库; Datasheet: https://atta.szlcsc.com/upload/public/pdf/source/20191125/C461412_D06D094152DCAA63D23E11D143615915.pdf; Supplier: LCSC; Reverse Stand-Off Voltage (Vrwm): 36V; Maximum Clamping Voltage: 58.1V; Peak Pulse Current (Ipp): 10.3A; Breakdown Voltage: 40V; Type: TVS
Q2-Q5 = CSD18540Q5B: 类型:1个N沟道;漏源电压(Vdss):60V;连续漏极电流(Id):100A;功率(Pd):3.1W；195W;导通电阻(RDS(on)@Vgs,Id):2.2mΩ@10V,28A;阈值电压(Vgs(th)@Id):2.3V@250uA;; LCSC Part Name: 1个N沟道 耐压:60V 电流:100A; Supplier Part: C86513; Manufacturer: TI(德州仪器); Supplier Footprint: VSON-8(5x6); JLCPCB Part Class: 扩展库; Datasheet: https://www.ti.com/cn/lit/gpn/csd18540q5b; Supplier: LCSC; Type: 1个N沟道; Drain Source Voltage (Vdss): 60V; Continuous Drain Current (Id): 100A; Power Dissipation (Pd): 3.1W；195W; Drain Source On Resistance (RDS(on)@Vgs,Id): 2.2mΩ@10V,28A; Gate Threshold Voltage (Vgs(th)@Id): 2.3V@250uA; Total Gate Charge (Qg@Vgs): 53nC@10V; Input Capacitance (Ciss@Vds): 4.23nF@30V; Operating Temperature: -55℃~+150℃@(Tj)
U5 U8 U9 U11 = SS54: Supplier Part: C9900023219; Supplier Footprint: (1N5824)DO-214; JLCPCB Part Class: 扩展库; Supplier: LCSC
U6 = PQ2620-220M-D: 电感值:22uH;精度:±20%;饱和电流(Isat):28A;温升电流:23A; LCSC Part Name: 22uH ±20% 25A; Supplier Footprint: SMD,27x24mm; JLCPCB Part Class: Extended Part; Tolerance: ±20%; Saturation Current (Isat): 28A; DC Resistance (DCR): 4.5mΩ
U7 U10 = UCC27282DR: 驱动配置:半桥;负载类型:MOSFET;驱动通道数:2;峰值灌电流:3.5A;峰值拉电流:2.5A;电源电压:5.5V~16V;上升时间:12ns;下降时间:10ns;; Supplier Part: C2867844; Manufacturer: TI(德州仪器); Supplier Footprint: SOIC-8; JLCPCB Part Class: 扩展库; Datasheet: https://www.ti.com/cn/lit/gpn/ucc27282; Supplier: LCSC; Driven Configuration: 半桥; Load Type: MOSFET; Number of Drivers: 2; Peak Output Current(sink): 3.5A; Peak Output Current(source): 2.5A; Supply Voltage: 5.5V~16V; Rise Time: 12ns; Fall Time: 10ns; Operating Temperature: -40℃~+125℃
Battery Cap Chassis = XT30U-M: 类别:-;类型1:-;; LCSC Part Name: AMASS(艾迈斯)轻量版锂电池插头公头 XT30U-M; Supplier Part: C99101; Manufacturer: AMASS(艾迈斯); JLCPCB Part Class: 扩展库; Datasheet: https://atta.szlcsc.com/upload/public/pdf/source/20170606/1496716542582.pdf; Supplier: LCSC; Brand: 艾迈斯; Type: 插头; Colour: 黄色; InterfaceType: 公头
M1-M4 = M3_cut_out: M3_隔离电气连接
U30 = 嘉立创二维码8x8
R64 = SD2512FR002E3WPKH: 电阻类型:-;阻值:2mΩ;精度:±1%;额定压降:-;功率:3W;温度系数:±50ppm/℃;安装方式:-;; LCSC Part Name: 2mΩ ±1% 3W; Supplier Part: C3152758; Manufacturer: Sunway(信维通信); Supplier Footprint: 2512; JLCPCB Part Class: 扩展库; Datasheet: https://atta.szlcsc.com/upload/public/pdf/source/20220727/82D957F8F38AEA0AC223226FA75DD8DE.pdf; Supplier: LCSC; Tolerance: ±1%; Power(Watts): 3W; Temperature Coefficient: ±50ppm/℃
U24 = REF3033AIDBZR: 输出类型:固定;输入电压:3.35V~5.5V;输出电压:3.3V;输出电流:25mA;精度:±0.2%;; Supplier Part: C36658; Manufacturer: TI(德州仪器); Supplier Footprint: SOT-23; JLCPCB Part Class: 扩展库; Datasheet: https://www.ti.com/cn/lit/gpn/ref3020; Supplier: LCSC; Output Type: 固定; Input Voltage: 3.35V~5.5V; Output Voltage: 3.3V; Output Current: 25mA; Tolerance: ±0.2%; Temperature Coefficient: 75ppm/℃; Reference Type: 串联; Supply Current: 50uA; Noise - 10Hz to 10kHz: 105uVrms; Operating Temperature: -40℃~+125℃@(Ta)
U25 U27 U29 = INA240A1PWR: 放大器数:单路;; Supplier Part: C93965; Manufacturer: TI(德州仪器); Supplier Footprint: TSSOP-8; JLCPCB Part Class: 扩展库; Datasheet: https://www.ti.com/cn/lit/gpn/ina240; Supplier: LCSC; Number of Channels: 单路; Supply Current: 1.8mA; Operating Temperature: -40℃~+125℃
U26 U28 = 0R005/1%3W/R2512: Supplier Part: C9900010686; JLCPCB Part Class: 扩展库; Supplier: LCSC
U31 = OPA2365AIDR: 放大器数:双路;增益带宽积(GBP):50MHz;输入偏置电流(Ib):0.2pA;输入失调电压(Vos):100uV;压摆率(SR):25V/us;带宽(-3db):-;轨到轨:-;; Supplier Part: C130011; Manufacturer: TI(德州仪器); Supplier Footprint: SOIC-8; JLCPCB Part Class: 扩展库; Datasheet: https://www.ti.com/cn/lit/gpn/opa2365; Supplier: LCSC; Number of Circuits: 双路; Gain Bandwidth Product(GBP): 50MHz; Current - Input Bias(Ib): 0.2pA; Voltage - Input Offset(Vos): 100uV; Slew Rate(SR): 25V/us; Output Current: 65mA; Supply Current: 4.6mA; Operating Temperature: -40℃~+125℃
C35 C57 = CAP_1206: Supplier Footprint: 1206
D16 D20 = DSK36: 二极管配置:独立式;正向压降(Vf):700mV@3A;直流反向耐压(Vr):60V;整流电流:3A;; LCSC Part Name: 电压:60V 电流:3A; Supplier Part: C727077; Manufacturer: TWGMC(台湾迪嘉); Supplier Footprint: SOD-123FL; JLCPCB Part Class: 扩展库; Datasheet: https://atta.szlcsc.com/upload/public/pdf/source/20200828/C727076_B37FCA1E25E95F22A97D5A5D18D72E25.pdf; Supplier: LCSC; Diode Configuration: 独立式; Forward Voltage (Vf@If): 700mV@3A; Reverse Voltage (Vr): 60V; Rectified Current: 3A; Reverse Leakage Current (Ir): 500uA
F1 = BSMD1206-035-16V: 最大电压:16V;最大电流:40A;保持电流:350mA;跳闸电流:750mA;; LCSC Part Name: 16V 350mA 1206自恢复; Supplier Part: C910827; Manufacturer: BHFUSE(佰宏); Supplier Footprint: 1206; JLCPCB Part Class: 扩展库; Datasheet: https://atta.szlcsc.com/upload/public/pdf/source/20230512/E419278EC8529AAF514173EF221BCF4B.pdf; Supplier: LCSC; Operating Voltage (Max): 16V; Current Rating (Max): 40A; Hold Current: 350mA; Trip Current: 750mA; Power Dissipation: 600mW; Resistance - Initial (Ri) (Min): 250mΩ; Resistance - Post Trip (R1) (Max): 1.5Ω; Maximum Time to Trip: 100ms; Operating Temperature: -40℃~+85℃
FB1 = GZ1608D601TF: 标称阻抗@测试频率:600Ω@100MHz;误差:±25%;直流电阻(RDC):450mΩ;; LCSC Part Name: 单路 0603磁珠 阻抗600Ω@100MHz; Supplier Part: C1002; Manufacturer: Sunlord(顺络); Supplier Footprint: 0603; JLCPCB Part Class: 基础库; Datasheet: https://atta.szlcsc.com/upload/public/pdf/source/20210830/355EA7C0FAC5394FC0FE3F17C770C20A.pdf; Supplier: LCSC; Impedance @ Frequency: 600Ω@100MHz; Tolerance: ±25%; DC Resistance: 450mΩ; Current Rating: 200mA; Circuits: 1
L2 L4 = 0650-2.2UH: Supplier Part: C9900012394; Manufacturer Part: 0650-10UH; Supplier Footprint: SMD_0650; JLCPCB Part Class: 扩展库; Supplier: LCSC
U12 = SMD0805-200 2A 30V: Supplier Part: C9900012346; JLCPCB Part Class: 扩展库; Supplier: LCSC
U13 U21 = TPS54560DDAR: 功能类型:降压型;输出类型:可调;工作电压:4.5V~60V;输出电压:800mV~58.8V;输出电流:5A;; LCSC Part Name: 4.5V至60V输入,5A降压DC-DC转换器; Supplier Part: C31966; Manufacturer: TI(德州仪器); Supplier Footprint: SOIC-8-EP; JLCPCB Part Class: 扩展库; Datasheet: https://www.ti.com/cn/lit/gpn/tps54560; Supplier: LCSC; Function: 降压型; Output Type: 可调; Input Voltage: 4.5V~60V; Output Voltage: 800mV~58.8V; Output Current: 5A; Switching Frequency: 2.5MHz; Operating Temperature: -40℃~+150℃@(TJ); Synchronous Rectification: 否; Number of Outputs: 1; Topology: 降压式; Switch tube (built-in/external): 内置
U14 U17 U22 = CS47UF50V167RV0158: 容值:47uF;精度:±20%;额定电压:50V;纹波电流:63mA@120Hz;等效串联电阻:-;; LCSC Part Name: 47uF ±20% 50V; Supplier Part: C5250969; Manufacturer: KNSCHA(科尼盛); Supplier Footprint: SMD,D6.3xL7.7mm; JLCPCB Part Class: 扩展库; Datasheet: https://atta.szlcsc.com/upload/public/pdf/source/20221116/6287524507036F7BFBE9B8F7F30DD2B3.pdf; Supplier: LCSC; Tolerance: ±20%; Rated Voltage: 50V; Ripple Current: 63mA@120Hz; φD: 6.3mm; L: 7.7mm; Lifetime @ Temp: 2000hrs@105℃; Operating Temperature: -55℃~+105℃
U16 = AMS1117-3.3: 输出类型:-;; Supplier Part: C880752; Manufacturer: Slkor(萨科微); Supplier Footprint: SOT-89; JLCPCB Part Class: Extended Part; Datasheet: https://atta.szlcsc.com/upload/public/pdf/source/20201231/C426566_7F22DB93439D00F3FA27143E4F28C6AA.pdf; Supplier: LCSC
U18 U19 = LC-LL-34: Supplier Part: C9900008805; Supplier Footprint: ZMM18V/0.5W; JLCPCB Part Class: 扩展库; Supplier: LCSC

## Nets
12V: C17.2 C18.2 C19.2 C26.2 C31.2 C32.2 F1.2 U7.1(VDD) U10.1(VDD)
24V: C21.1 C22.1 C24.2 C25.2 C40.2 C41.2 C62.2 C63.2 D8.2(A) Q2.5(D) Q2.6(D) Q2.7(D) Q2.8(D) R33.2 R41.2 R51.1 R58.1 R59.1 U5.1(C) U13.2(VIN) U17.1 U21.2(VIN) U26.1 U28.2
+3.3V: BUZZER1.1(+) C1.2 C2.2 C6.2 C7.2 C9.2 C14.1 C15.1 C16.2 C46.2 C47.2 C70.2 C76.2 C77.2 C84.2 C90.2 C91.2 D3.2 GH1.4 GH2.4 LED1.1(A) LED2.1(A) LED3.1(A) R7.2 SWD1.4 U1.1(VBAT) U1.16(VDD) U1.29(VDDA) U1.32(VDD) U1.48(VDD) U1.64(VDD) U16.2(VOUT) U18.1(K) U25.5(VS) U27.5(VS) U29.5(VS) U31.8(V+)
+5V: C12.2 C48.2 C49.2 C68.2 D1.5(VCC) D2.5(VCC) FB1.1 U3.3(VCC) U16.3(VIN) U19.1(K) U24.1(IN)
AGND: C68.1 C69.2 C72.2 C76.1 C77.1 C78.2 C80.2 C84.1 C85.2 C87.2 C90.1 C91.1 R6.2 R66.2 U24.3(GND) U25.4(GND) U25.7(REF1) U27.4(GND) U27.7(REF1) U29.4(GND) U29.7(REF1)
GND: Battery.2 C1.1 C2.1 C4.2 C5.2 C6.1 C7.1 C8.2 C9.1 C10.2 C11.2 C12.1 C13.1 C14.2 C15.2 C16.1 C17.1 C18.1 C19.1 C21.2 C22.2 C24.1 C25.1 C26.1 C27.2 C29.1 C30.1 C31.1 C32.1 C35.1 C36.1 C37.1 C38.1 C39.1 C40.1 C41.1 C44.1 C45.1 C46.1 C47.1 C48.1 C49.1 C57.1 C62.1 C63.1 C66.1 C67.1 C70.1 C71.2 C74.1 C75.1 C79.2 C82.1 C83.1 C86.2 C89.1 C92.2 C93.2 CAN2.3 CAN2.4 Cap.2 Chassis.2 D1.2(GND) D2.2(GND) D3.1 D8.1(K) D16.1(A) D20.1(A) GH1.1 GH1.5 GH1.6 GH2.1 GH2.5 GH2.6 Q1.2(E) Q3.1(S) Q3.2(S) Q3.3(S) Q5.1(S) Q5.2(S) Q5.3(S) R6.1 R16.1 R21.2 R22.2 R24.1 R28.2 R29.2 R31.1 R35.1 R36.1 R37.1 R43.1 R44.1 R45.1 R49.1 R53.1 R56.1 R60.1 R66.1 SWD1.1 SWD1.5 SWD1.6 U1.15(VSS) U1.27(VSSA) U1.31(VSS) U1.47(VSS) U1.63(VSS) U2.2(GND) U2.4(GND) U3.2(GND) U3.8(S) U4.1 U7.7(VSS) U8.2(A) U10.7(VSS) U11.2(A) U13.7(GND) U13.9(EP) U14.2 U16.1(ADJ/GND) U17.2 U18.2(A) U19.2(A) U21.7(GND) U21.9(EP) U22.2 U27.1(NC) U29.1(NC) U31.4(V-)
ADC3_IN1: C82.2 R57.2 U1.25(PB1)
ADC4_IN3: U1.34(PB12)
ADC4_IN4: C74.2 R50.2 U1.36(PB14)
BAT: Battery.1 R48.1 U26.2
BUZZ: R14.1 U1.14(PA2)
CAN1_RX: D1.3(I/O) R8.2 U1.61(PB8-BOOT0)
CAN1_TX: D1.4(I/O) U1.62(PB9) U3.1(TXD)
Cap_B: Cap.1 R64.1 R65.1
Cap_Front: C27.1 C29.2 C30.2 D21.1(K) Q4.5(D) Q4.6(D) Q4.7(D) Q4.8(D) R52.1 R63.1 R64.2 U9.1(C)
Chassis_current: C92.1 C93.1 Chassis.1 R61.1 U28.1
CLK: D2.4(I/O) R4.2 U1.50(PA14)
DIO: D2.3(I/O) R3.2 U1.49(PA13)
LED1: R13.2 U1.8(PC0)
LED2: R15.2 U1.9(PC1)
LED3: R17.2 U1.10(PC2)
OPAMP1_VINP: C78.1 R54.2 U1.17(PA3)
OPAMP2_VINP: C69.1 R46.2 U1.21(PA7)
OPAMP4_VINP: C85.1 R62.2 U1.33(PB11)
OSC_IN: C4.1 R5.1 U1.5(PF0-OSC_IN) U2.1(OSC1)
OSC_OUT: C5.1 R5.2 U1.6(PF1-OSC_OUT) U2.3(OSC2)
RESET: C13.2 R7.1 U1.7(PG10-NRST) U4.2
Timer_A1: R21.1 U1.42(PA8) U7.5(HI)
Timer_A2: R22.1 U1.43(PA9) U7.6(LI)
Timer_B1: R29.1 U1.44(PA10) U10.6(LI)
Timer_B2: R28.1 U1.45(PA11) U10.5(HI)
U1_RX: D1.1(I/O) R1.2 U1.60(PB7)
U1_TX: D1.6(I/O) GH1.2 U1.59(PB6)
U3_RX: D2.6(I/O) R9.2 U1.53(PC11)
U3_TX: D2.1(I/O) GH2.2 U1.52(PC10)
VREF3.3: C10.1 C11.1 C72.1 C80.1 C87.1 U1.28(VREF+) U24.2(OUT) U25.6(REF2) U27.6(REF2) U29.6(REF2)
$BUZZER1_2: BUZZER1.2(-) Q1.3(C)
$C8_1: C8.1 U3.5(n.c.)
$C20_1: C20.1 Q2.1(S) Q2.2(S) Q2.3(S) Q3.5(D) Q3.6(D) Q3.7(D) Q3.8(D) R19.2 U5.2(A) U6.2 U7.4(HS) U8.1(C)
$C20_2: C20.2 U7.2(HB)
$C33_1: C33.1 D21.2(A) Q4.1(S) Q4.2(S) Q4.3(S) Q5.5(D) Q5.6(D) Q5.7(D) Q5.8(D) R26.2 U6.1 U9.2(A) U10.4(HS) U11.1(C)
$C33_2: C33.2 U10.2(HB)
$C34_1: C34.1 U13.1(BOOT)
$C34_2: C34.2 D16.2(K) L2.1 U13.8(SW)
$C35_2: C35.2 C36.2 C37.2 C38.2 C39.2 L2.2 R32.2 U12.1 U14.1
$C44_2: C44.2 R34.2 U13.6(COMP)
$C45_2: C45.2 R34.1
$C56_1: C56.1 U21.1(BOOT)
$C56_2: C56.2 D20.2(K) L4.1 U21.8(SW)
$C57_2: C57.2 F1.1 L4.2 R40.2 U22.1
$C66_2: C66.2 R42.2 U21.6(COMP)
$C67_2: C67.2 R42.1
$C71_1: C71.1 C73.2 R48.2 U25.2(IN+)
$C73_1: C73.1 C75.2 R51.2 U25.3(IN-)
$C79_1: C79.1 C81.2 R58.2 U27.2(IN+)
$C81_1: C81.1 C83.2 R61.2 U27.3(IN-)
$C86_1: C86.1 C88.2 R63.2 U29.2(IN+)
$C88_1: C88.1 C89.2 R65.2 U29.3(IN-)
$CAN2_1: CAN2.1 R10.1 U3.7(CANH)
$CAN2_2: CAN2.2 R10.2 U3.6(CANL)
$D7_1: D7.1(K) R20.1 U7.3(HO)
$D7_2: D7.2(A) Q2.4(G) R19.1 R20.2
$D10_1: D10.1(K) R23.1 U7.8(LO)
$D10_2: D10.2(A) Q3.4(G) R23.2 R24.2
$D13_1: D13.1(K) R27.1 U10.3(HO)
$D13_2: D13.2(A) Q4.4(G) R26.1 R27.2
$D15_1: D15.1(K) R30.1 U10.8(LO)
$D15_2: D15.2(A) Q5.4(G) R30.2 R31.2
$FB1_2: FB1.2 U12.2
$GH1_3: GH1.3 R1.1
$GH2_3: GH2.3 R9.1
$LED1_2: LED1.2(C) R13.1
$LED2_2: LED2.2(C) R15.1
$LED3_2: LED3.2(C) R17.1
$Q1_1: Q1.1(B) R14.2 R16.2
$R3_1: R3.1 SWD1.3
$R4_1: R4.1 SWD1.2
$R8_1: R8.1 U3.4(RXD)
$R32_1: R32.1 R36.2 U13.5(FB)
$R33_1: R33.1 R37.2 U13.3(EN)
$R35_2: R35.2 U13.4(RT/CLK)
$R40_1: R40.1 R44.2 U21.5(FB)
$R41_1: R41.1 R45.2 U21.3(EN)
$R43_2: R43.2 U21.4(RT/CLK)
$R46_1: R46.1 U25.8(OUT)
$R47_1: R47.1 R49.2 U31.6(IN B-)
$R47_2: R47.2 R50.1 U31.7(VOUT B)
$R52_2: R52.2 R53.2 U31.5(IN B+)
$R54_1: R54.1 U27.8(OUT)
$R55_1: R55.1 R56.2 U31.2(IN A-)
$R55_2: R55.2 R57.1 U31.1(VOUT A)
$R59_2: R59.2 R60.2 U31.3(IN A+)
$R62_1: R62.1 U29.8(OUT)

Not connected (* = marked no-connect by the designer): U1 2(PC13) 3(PC14-OSC32_IN) 4(PC15-OSC32_OUT) 11(PC3) 12(PA0) 13(PA1) 18(PA4) 19(PA5) 20(PA6) 22(PC4) 23(PC5) 24(PBO) 26(PB2) 30(PB10) 35(PB13) 37(PB15) 38(PC6) 39(PC7) 40(PC8) 41(PC9) 46(PA12) 51(PA15) 54(PC12) 55(PD2) 56(PB3) 57(PB4) 58(PB5); U25 1(NC)

## Notes on the sheets
sheet 3
- 4.8V
- 0.8V
- UVLO：7Vₛₜₐᵣₜ-5Vₛₜₒₚ
- 10.5V
- 0.8V
- UVLO：12Vₛₜₐᵣₜ-10Vₛₜₒₚ
